# Altium schematic sheet Sheet1.SchDoc
size A4; SheetNumber: 1; SheetTotal: 1
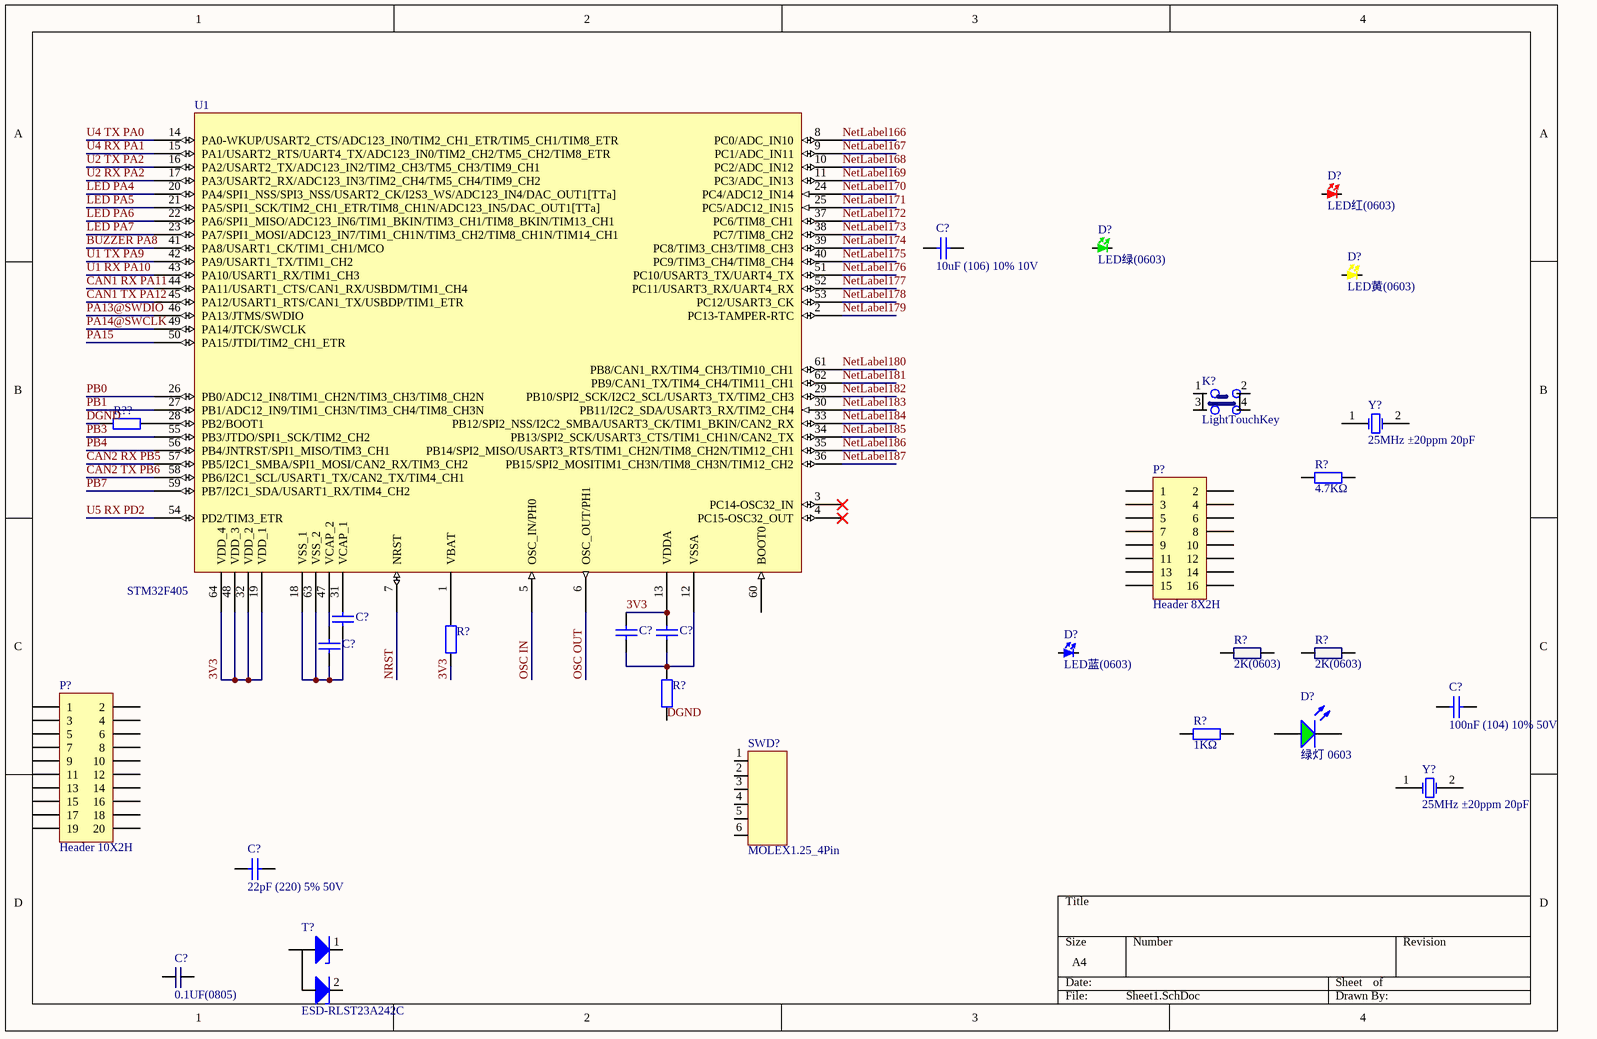
[diagram p0: Sheet1.SchDoc]

## Parts
(Parts that share a designator on the sheet are numbered #1, #2 ... from top to bottom, then left to right.)
C?#1  10uF (106) 10% 10V  [0603_C]
C?#2  2.2uF (225) 10% 16V  [0603_C]  (value not drawn)
C?#3  10nF (103) 10% 50V  [0603_C]  (value not drawn)
C?#4  1uF (105) 10% 50V  [0603_C]  (value not drawn)
C?#5  2.2uF (225) 10% 16V  [0603_C]  (value not drawn)
C?#6  100nF (104) 10% 50V  [0603_C]
C?#7  22pF (220) 5% 50V  [0603_C]
C?#8  0.1UF(0805)  [0805_C]
D?#1  LED红(0603)  [LED红(0603)]
D?#2  LED绿(0603)  [LED绿（0603）]
D?#3  LED黄(0603)  [LED黄(0603)]
D?#4  LED蓝(0603)  [LED蓝(0603)]
D?#5  绿灯 0603  [0603_LED_S1]
K?  LightTouchKey  [LightTouchKey]
P?#1  Header 8X2H  [HDR2X8H]
P?#2  Header 10X2H  [HDR2X10H]
R?#1  4.7KΩ  [0603_R]
R?#2  0Ω (0R0) ±1%  [0603_R]  (value not drawn)
R?#3  2K(0603)  [RES(0603)]
R?#4  2K(0603)  [RES(0603)]
R?#5  0Ω (0R0) ±1%  [0603_R]  (value not drawn)
R?#6  1KΩ  [0603_R]
R??  10KΩ (1002) ±1%  [0603_R]  (value not drawn)
SWD?  MOLEX1.25_4Pin  [MOLEX1.25_4Pin]
T?  ESD-RLST23A242C  [ESD-RLST23A242C]
U1  STM32F405  [STM32F103RBT6]
Y?#1  25MHz ±20ppm 20pF  [SMD-5032_2P]
Y?#2  25MHz ±20ppm 20pF  [SMD-5032_2P]

## Nets
3V3: C?#3.2 C?#4.2 R?#2.1 U1.13(VDDA) U1.19(VDD_1) U1.32(VDD_2) U1.48(VDD_3) U1.64(VDD_4)
BUZZER PA8: U1.41(PA8/USART1_CK/TIM1_CH1/MCO)
CAN1 RX PA11: U1.44(PA11/USART1_CTS/CAN1_RX/USBDM/TIM1_CH4)
CAN1 TX PA12: U1.45(PA12/USART1_RTS/CAN1_TX/USBDP/TIM1_ETR)
CAN2 RX PB5: U1.57(PB5/I2C1_SMBA/SPI1_MOSI/CAN2_RX/TIM3_CH2)
CAN2 TX PB6: U1.58(PB6/I2C1_SCL/USART1_TX/CAN2_TX/TIM4_CH1)
DGND: R?#5.1 R??.1
LED PA4: U1.20(PA4/SPI1_NSS/SPI3_NSS/USART2_CK/I2S3_WS/ADC123_IN4/DAC_OUT1[TTa])
LED PA5: U1.21(PA5/SPI1_SCK/TIM2_CH1_ETR/TIM8_CH1N/ADC123_IN5/DAC_OUT1[TTa])
LED PA6: U1.22(PA6/SPI1_MISO/ADC123_IN6/TIM1_BKIN/TIM3_CH1/TIM8_BKIN/TIM13_CH1)
LED PA7: U1.23(PA7/SPI1_MOSI/ADC123_IN7/TIM1_CH1N/TIM3_CH2/TIM8_CH1N/TIM14_CH1)
NetLabel166: U1.8(PC0/ADC_IN10)
NetLabel167: U1.9(PC1/ADC_IN11)
NetLabel168: U1.10(PC2/ADC_IN12)
NetLabel169: U1.11(PC3/ADC_IN13)
NetLabel170: U1.24(PC4/ADC12_IN14)
NetLabel171: U1.25(PC5/ADC12_IN15)
NetLabel172: U1.37(PC6/TIM8_CH1)
NetLabel173: U1.38(PC7/TIM8_CH2)
NetLabel174: U1.39(PC8/TIM3_CH3/TIM8_CH3)
NetLabel175: U1.40(PC9/TIM3_CH4/TIM8_CH4)
NetLabel176: U1.51(PC10/USART3_TX/UART4_TX)
NetLabel177: U1.52(PC11/USART3_RX/UART4_RX)
NetLabel178: U1.53(PC12/USART3_CK)
NetLabel179: U1.2(PC13-TAMPER-RTC)
NetLabel180: U1.61(PB8/CAN1_RX/TIM4_CH3/TIM10_CH1)
NetLabel181: U1.62(PB9/CAN1_TX/TIM4_CH4/TIM11_CH1)
NetLabel182: U1.29(PB10/SPI2_SCK/I2C2_SCL/USART3_TX/TIM2_CH3)
NetLabel183: U1.30(PB11/I2C2_SDA/USART3_RX/TIM2_CH4)
NetLabel184: U1.33(PB12/SPI2_NSS/I2C2_SMBA/USART3_CK/TIM1_BKIN/CAN2_RX)
NetLabel185: U1.34(PB13/SPI2_SCK/USART3_CTS/TIM1_CH1N/CAN2_TX)
NetLabel186: U1.35(PB14/SPI2_MISO/USART3_RTS/TIM1_CH2N/TIM8_CH2N/TIM12_CH1)
NetLabel187: U1.36(PB15/SPI2_MOSITIM1_CH3N/TIM8_CH3N/TIM12_CH2)
NRST: U1.7(NRST)
OSC IN: U1.5(OSC_IN/PH0)
OSC OUT: U1.6(OSC_OUT/PH1)
PA13@SWDIO: U1.46(PA13/JTMS/SWDIO)
PA14@SWCLK: U1.49(PA14/JTCK/SWCLK)
PA15: U1.50(PA15/JTDI/TIM2_CH1_ETR)
PB0: U1.26(PB0/ADC12_IN8/TIM1_CH2N/TIM3_CH3/TIM8_CH2N)
PB1: U1.27(PB1/ADC12_IN9/TIM1_CH3N/TIM3_CH4/TIM8_CH3N)
PB3: U1.55(PB3/JTDO/SPI1_SCK/TIM2_CH2)
PB4: U1.56(PB4/JNTRST/SPI1_MISO/TIM3_CH1)
PB7: U1.59(PB7/I2C1_SDA/USART1_RX/TIM4_CH2)
U1 RX PA10: U1.43(PA10/USART1_RX/TIM1_CH3)
U1 TX PA9: U1.42(PA9/USART1_TX/TIM1_CH2)
U2 RX PA2: U1.17(PA3/USART2_RX/ADC123_IN3/TIM2_CH4/TM5_CH4/TIM9_CH2)
U2 TX PA2: U1.16(PA2/USART2_TX/ADC123_IN2/TIM2_CH3/TM5_CH3/TIM9_CH1)
U4 RX PA1: U1.15(PA1/USART2_RTS/UART4_TX/ADC123_IN0/TIM2_CH2/TM5_CH2/TIM8_ETR)
U4 TX PA0: U1.14(PA0-WKUP/USART2_CTS/ADC123_IN0/TIM2_CH1_ETR/TIM5_CH1/TIM8_ETR)
U5 RX PD2: U1.54(PD2/TIM3_ETR)
NetC?#2_1: C?#2.1 C?#5.1 U1.18(VSS_1) U1.63(VSS_2)
NetC?#3_1: C?#3.1 C?#4.1 R?#5.2 U1.12(VSSA)
NetC?#5_2: C?#5.2 U1.47(VCAP_2)
NetR?#2_2: R?#2.2 U1.1(VBAT)
NetR??_2: R??.2 U1.28(PB2/BOOT1)

Not connected (* = marked no-connect by the designer): C?#1 1 2; C?#2 2; C?#6 1 2; C?#7 1 2; C?#8 1 2; D?#1 1 2; D?#2 1 2; D?#3 1 2; D?#4 1 2; D?#5 A K; K? 1 2 3 4; P?#1 1 2 3 4 5 6 7 8 9 10 11 12 13 14 15 16; P?#2 1 2 3 4 5 6 7 8 9 10 11 12 13 14 15 16 17 18 19 20; R?#1 1 2; R?#3 1 2; R?#4 1 2; R?#6 1 2; SWD? 1 2 3 4 5 6; T? 1(K1) 2(K2) 3(A); U1 3(PC14-OSC32_IN)* 4(PC15-OSC32_OUT)* 31(VCAP_1) 60(BOOT0); Y?#1 1(OSC1) 2(OSC2); Y?#2 1(OSC1) 2(OSC2)

## Library data of the parts
C?#1 = 0603 10uF (106) 10% 10V: 贴片电容; ComponentLink1Description: 供应商链接; ComponentLink1URL: http://www.szlcsc.com/product/details_20411.html; Package: 0603; Supplier: LC; SuppliersPartNumber: C19702
C?#2 C?#5 = 0603 2.2uF (225) 10% 16V: 贴片电容; ComponentLink1Description: 供应商链接; ComponentLink1URL: http://www.szlcsc.com/product/details_24366.html; Package: 0603; Supplier: LC; SuppliersPartNumber: C23630
C?#3 = 0603 10nF (103) 10% 50V: 贴片电容; ComponentLink1Description: 供应商链接; ComponentLink1URL: http://www.szlcsc.com/product/details_58143.html; Package: 0603; Supplier: LC; SuppliersPartNumber: C57112
C?#4 = 0603 1uF (105) 10% 50V: 贴片电容; ComponentLink1Description: 供应商链接; ComponentLink1URL: http://www.szlcsc.com/product/details_16531.html; Package: 0603; Supplier: LC; SuppliersPartNumber: C15849
C?#6 = 0603 100nF (104) 10% 50V: 贴片电容; ComponentLink1Description: 供应商链接; ComponentLink1URL: http://www.szlcsc.com/product/details_15331.html; Package: 0603; Supplier: LC; SuppliersPartNumber: C14663
C?#7 = 0603 22pF (220) 5% 50V: 贴片电容; ComponentLink1Description: 供应商链接; ComponentLink1URL: http://www.szlcsc.com/product/details_2005.html; Package: 0603; Supplier: LC; SuppliersPartNumber: C1653
C?#8 = CAP(0805)
D?#5 = 0603 绿灯: 发光二极管; ComponentLink1Description: 供应商链接; ComponentLink1URL: http://www.szlcsc.com/product/details_73152.html; Package: 0603; Supplier: LC; SuppliersPartNumber: C72043
P?#1 = Header 8X2H: Header, 8-Pin, Dual row, Right Angle; LatestRevisionDate: 17-Jul-2002; LatestRevisionNote: Re-released for DXP Platform.; Publisher: Altium Limited
P?#2 = Header 10X2H: Header, 10-Pin, Dual row, Right Angle; LatestRevisionDate: 17-Jul-2002; LatestRevisionNote: Re-released for DXP Platform.; Publisher: Altium Limited
R?#1 = 0603 4.7KΩ (4701) 1%: 贴片电阻; ComponentLink1Description: 供应商链接; ComponentLink1URL: http://www.szlcsc.com/product/details_23889.html; Package: 0603; Supplier: LC; SuppliersPartNumber: C23162
R?#2 R?#5 = 0603 0Ω (0R0) 1%: 贴片电阻; ComponentLink1Description: 供应商链接; ComponentLink1URL: http://www.szlcsc.com/product/details_21903.html; Package: 0603; Supplier: LC; SuppliersPartNumber: C21189
R?#3 R?#4 = RES(0603)
R?#6 = 0603 1KΩ (1001) 1%: 贴片电阻; ComponentLink1Description: 供应商链接; ComponentLink1URL: http://www.szlcsc.com/product/details_21904.html; Package: 0603; Supplier: LC; SuppliersPartNumber: C21190
R?? = 0603 10KΩ (1002) 1%: 贴片电阻; ComponentLink1Description: 供应商链接; ComponentLink1URL: http://www.szlcsc.com/product/details_26547.html; Package: 0603; Supplier: LC; SuppliersPartNumber: C25804
U1 = STM32F405/407 RG
Y?#1 Y?#2 = SMD-5032_2P 8MHz 20ppm 20pF: 贴片晶振; ComponentLink1Description: 供应商链接; ComponentLink1URL: http://www.szlcsc.com/product/details_117214.html; Package: SMD-5032_2P; Supplier: LC; SuppliersPartNumber: C115962